# EAGLE design accelerometer_board (EAGLE 7.2.0)
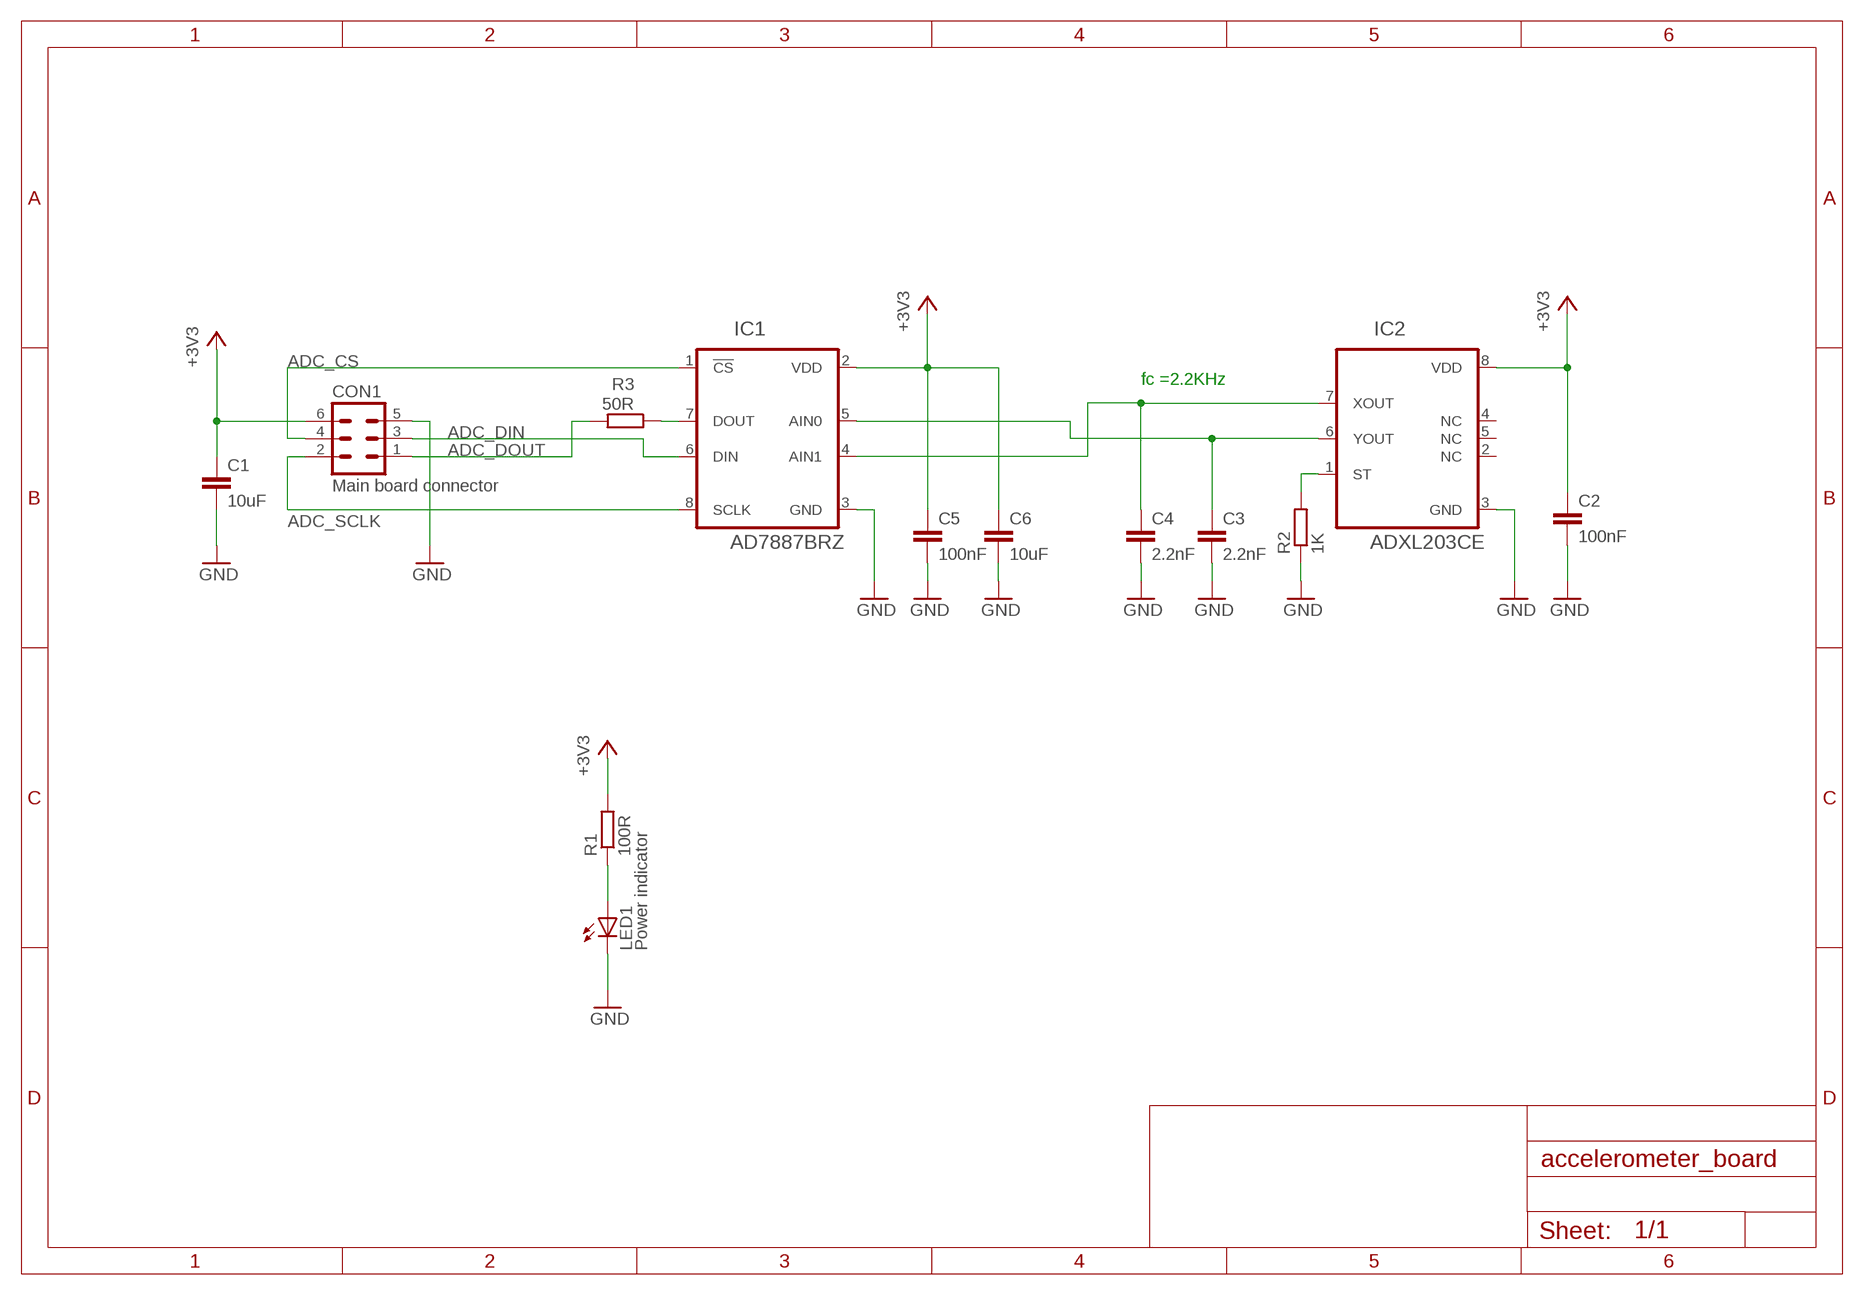
[diagram p0: schematic, sheet 1]

## Parts
C1  10uF  C-EUC1206K  [C1206K]
C2  100nF  C-EUC0805K  [C0805K]
C3  2.2nF  C-EUC0805K  [C0805K]
C4  2.2nF  C-EUC0805K  [C0805K]
C5  100nF  C-EUC0805K  [C0805K]
C6  10uF  C-EUC1206K  [C1206K]
CON1  Main board connector  ML6  [ML6]
IC1  AD7887BRZ  [SO08]
IC2  ADXL203CE  [LCC127P500X500X220-8N]
LED1  Power indicator  LEDCHIP-LED0805  [CHIP-LED0805]
R1  100R  R-EU_R0805  [R0805]
R2  1K  R-EU_R0805  [R0805]
R3  50R  R-EU_R0805  [R0805]

## Nets
+3V3 [power]: C1.1 C2.1 C5.1 C6.1 CON1.6 IC1.2(VDD) IC2.8(VDD) R1.2
ADC_CS: CON1.4 IC1.1(!CS)
ADC_DIN: CON1.3 IC1.6(DIN)
ADC_DOUT: CON1.1 R3.2
ADC_SCLK: CON1.2 IC1.8(SCLK)
GND [power]: C1.2 C2.2 C3.2 C4.2 C5.2 C6.2 CON1.5 IC1.3(GND) IC2.3(GND) LED1.C R2.1
N$5: C4.1 IC1.4(AIN1) IC2.7(XOUT)
N$7: LED1.A R1.1
N$8: IC2.1(ST) R2.2
N$9: IC1.7(DOUT) R3.1
N$10: C3.1 IC1.5(AIN0) IC2.6(YOUT)
Unconnected: IC2.2(NC) IC2.4(NC) IC2.5(NC)

## Notes on the sheet
- fc =2.2KHz

## Library data of the parts
C1-C6 = rcl:C-EU: CAPACITOR, European symbol
CON1 = con-harting-ml:ML6: HARTING; OC_FARNELL: unknown; OC_NEWARK: unknown
IC1 = tobylib:AD7887BRZ: AD7887: 2-channel 125Ksps 12bit ADC Datasheet <http://www.analog.com/media/en/technical-documentation/data-sheets/AD7887.pdf>
IC2 = tobylib:ADXL203CE: 2-axis Accelerometer ADXL203 Datasheet <http://www.analog.com/media/en/technical-documentation/data-sheets/ADXL103_203.pdf>; AVAILABILITY: Good; DESCRIPTION: Accelerometer Dual ±1.7g 3V to 6V 960mV/g to 1040mV/g 8-Pin CLCC T/R; MF: Analog Devices; MP: ADXL203CE-REEL; PACKAGE: CLCC-8 Analog Devices; PRICE: 19.20 USD
LED1 = led:LED: LED OSRAM: - CHIPLED LG R971, LG N971, LY N971, LG Q971, LY Q971, LO R971, LY R971 LH N974, LH R974 LS Q976, LO Q976, LY Q976 LO Q996 - Hyper CHIPLED LW Q18S LB Q993, LB Q99A, LB R99A - SideLED LS A670, LO A670, LY A670, LG A670, LP A670 LB A673, LV A673, LT A673, LW A673 LH A674 LY A675 LS A676, LA A676, LO A676, LY A676, LW A676 LS A679, LY A679, LG A679 - Hyper Micro SIDELED® LS Y876, LA Y876, LO Y876, LY Y876 LT Y87S - SmartLED LW L88C, LW L88S LB L89C, LB L89S, LG L890 LS L89K, LO L89K, LY L89K LS L896, LA L896, LO L896, LY L896 - TOPLED LS T670, LO T670, LY T670, LG T670, LP T670 LSG T670, LSP T670, LSY T670, LOP T670, LYG T670 LG T671, LOG T671, LSG T671 LB T673, LV T673, LT T673, LW T673 LH T674 LS T676, LA T676, LO T676, LY T676, LB T676, LH T676, LSB T676, LW T676 LB T67C, LV T67C, LT T67C, LS T67K, LO T67K, LY T67K, LW E67C LS E67B, LA E67B, LO E67B, LY E67B, LB E67C, LV E67C, LT E67C LW T67C LS T679, LY T679, LG T679 LS T770, LO T770, LY T770, LG T770, LP T770 LB T773, LV T773, LT T773, LW T773 LH T774 LS E675, LA E675, LY E675, LS T675 LS T776, LA T776, LO T776, LY T776, LB T776 LHGB T686 LT T68C, LB T68C - Hyper Mini TOPLED® LB M676 - Mini TOPLED Santana® LG M470 LS M47K, LO M47K, LY M47K Source: http://www.osram.convergy.de LUXEON: - LUMILED® LXK2-PW12-R00, LXK2-PW12-S00, LXK2-PW14-U00, LXK2-PW14-V00 LXK2-PM12-R00, LXK2-PM12-S00, LXK2-PM14-U00 LXK2-PE12-Q00, LXK2-PE12-R00, LXK2-PE12-S00, LXK2-PE14-T00, LXK2-PE14-U00 LXK2-PB12-K00, LXK2-PB12-L00, LXK2-PB12-M00, LXK2-PB14-N00, LXK2-PB14-P00, LXK2-PB14-Q00 LXK2-PR12-L00, LXK2-PR12-M00, LXK2-PR14-Q00, LXK2-PR14-R00 LXK2-PD12-Q00, LXK2-PD12-R00, LXK2-PD12-S00 LXK2-PH12-R00, LXK2-PH12-S00 LXK2-PL12-P00, LXK2-PL12-Q00, LXK2-PL12-R00 Source: www.luxeon.com KINGBRIGHT: KA-3528ASYC Source: www.kingbright.com
R1-R3 = rcl:R-EU_: RESISTOR, European symbol

## Net classes
1 power: width 0.61 mm

## Board
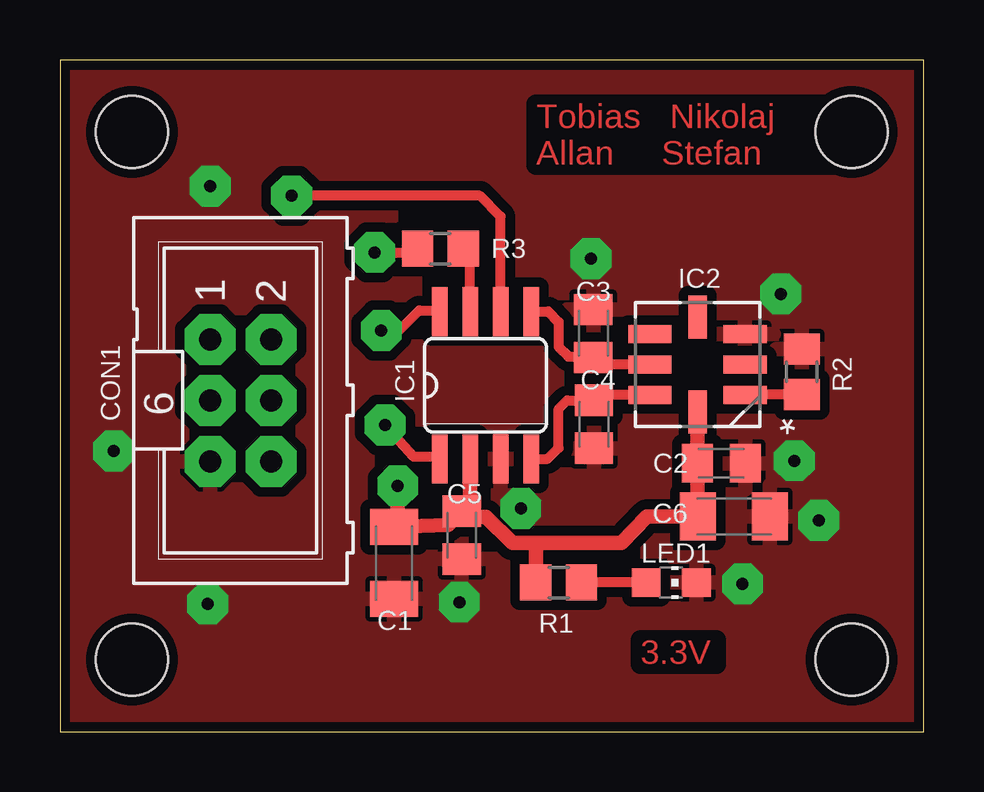
[diagram p1: board, top side]
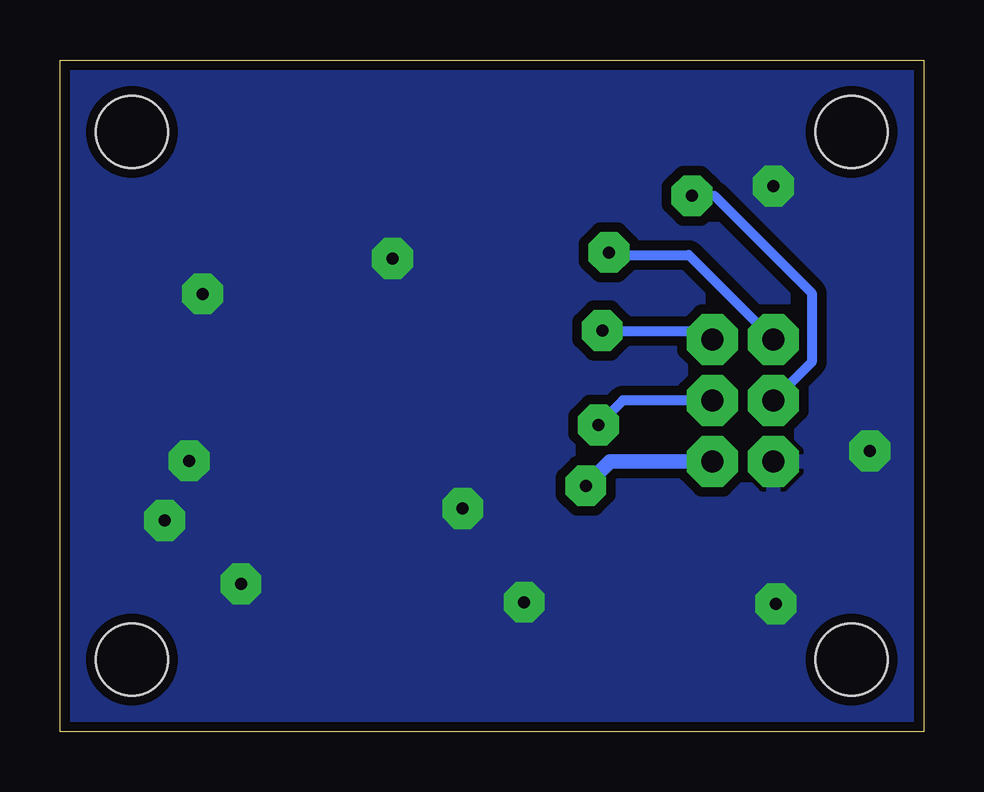
[diagram p2: board, bottom side, seen from below]

Size 36 x 28 mm. Coordinates in mm from the lower left corner, seen from the top.
Outline: 0,0 36,0 36,28 0,28 0,0
Copper layers (1*16): Top 0.035mm / dielectric 1.5mm / Bottom 0.035mm
Design rules "PCB-POOL Standard *": minimum track width 0.15mm, minimum drill 0.3mm, track to track 0.35mm, track to pad 0.3mm, pad to pad 0.2mm, via to via 0.15mm, smd to smd 0.15mm, copper to edge 0.3mm, drill to drill 0.2mm, minimum pad ring 0.6mm, minimum via ring 0.6mm, stop-mask expansion 0.075mm, vias tented up to drill 0mil, thermal gap 0.2mm
Holes 3 mm at 3,25 3,3 33,25 33,3

### Footprints (pad centres in the part's own frame; a part is rotated, then mirrored left to right if it is on the bottom)
C1206K = smd 1.5 x 2: 1 -1.5,0; 2 1.5,0
C0805K = smd 1.3 x 1.6: 1 -1,0; 2 1,0
ML6 = drill 0.914 octagon: 1 -2.54,-1.27; 2 -2.54,1.27; 3 0,-1.27; 4 0,1.27; 5 2.54,-1.27; 6 2.54,1.27
SO08 = smd 0.66 x 2.032: 1 -1.905,-3.073; 2 -0.635,-3.073; 3 0.635,-3.073; 4 1.905,-3.073; 5 1.905,3.073; 6 0.635,3.073; 7 -0.635,3.073; 8 -1.905,3.073
LCC127P500X500X220-8N = smd 1.803 x 0.762: 1 -1.981,1.27; 2 -1.981,0; 3 -1.981,-1.27; 5 1.981,-1.27; 6 1.981,0; 7 1.981,1.27 | smd 0.762 x 1.803: 4 0,-1.981; 8 0,1.981
CHIP-LED0805 = smd 1.2 x 1.2: A 0,-1.05; C 0,1.05
R0805 = smd 1.3 x 1.5: 1 -0.95,0; 2 0.95,0

### Placement (x,y rotation side)
C1  13.93,7.02 270 top
C2  27.57,11.19 0 top
C3  22.23,16.6 90 top
C4  22.26,12.81 270 top
C5  16.75,8.19 270 top
C6  28.1,8.98 0 top
CON1  7.53,13.8 270 top
IC1  17.74,14.44 0 top
IC2  26.58,15.3 180 top
LED1  25.49,6.21 270 top
R1  20.79,6.21 180 top
R2  30.92,15 270 top
R3  15.86,20.13 180 top

### Tracks (layer width: path | path; a pad name or v marks a point on that pad's centre or on a via)
+3V3  (via drill 0.5 pad 1.27)
  Top 0.61: IC2.8 C2.1 | C2.1 | C5.1 16.18,8.62 C1.1 14.08,8.75 v14.08,10.25 | IC1.2 17.1,9.54 C5.1 | 19.82,7.86 23.4,7.86 24.47,8.98 C6.1 26.58,8.83 C2.1 | 19.82,7.86 18.86,7.86 17.76,8.95 16.99,8.95 C5.1 | R1.2 19.84,7.84 19.82,7.86
  Bottom 0.61: CON1.6 13.06,11.26 v14.08,10.25
ADC_CS  (via drill 0.5 pad 1.27)
  Top 0.406: v13.55,12.79 14.74,11.47 15.73,11.47 IC1.1
  Bottom 0.406: CON1.4 12.53,13.8 v13.55,12.79
ADC_DIN  (via drill 0.5 pad 1.27)
  Top 0.406: IC1.6 18.37,21.47 17.51,22.34 v9.66,22.34
  Bottom 0.406: v9.66,22.34 8.72,22.34 4.66,18.27 4.66,15.4 CON1.3
ADC_DOUT  (via drill 0.5 pad 1.27)
  Top 0.406: v13.12,19.98 14.76,19.98 R3.2
  Bottom 0.406: 6.23,16.77 CON1.1 9.79,19.87 13.01,19.87 v13.12,19.98
ADC_SCLK  (via drill 0.5 pad 1.27)
  Top 0.406: v13.39,16.72 14.13,16.72 14.97,17.56 15.78,17.56 IC1.8
  Bottom 0.406: v13.39,16.72 13.37,16.7 9.15,16.7 CON1.2
GND  (via drill 0.5 pad 1.27)
  other vias: 19.21,9.31 6.26,22.74 22.13,19.72 30.06,18.25 31.63,8.8 30.62,11.29 28.46,6.16 2.24,11.69 6.16,5.32 16.65,5.4
  pour Bottom (isolate 0.406): -6.39,-4.26 -6.14,32.44 41.95,32.44 42.05,-4.08
  pour Top (isolate 0.406): -4.36,-2.13 -4.21,30.39 39.79,30.28 39.76,-2.15
N$5
  Top 0.406: IC2.7 22.48,14.03 C4.1 21.14,13.8 20.79,13.45 20.79,11.82 20.33,11.37 IC1.4
N$7
  Top 0.406: LED1.A R1.1
N$8
  Top 0.406: R2.2 28.57,14.05 IC2.1
N$9
  Top 0.406: IC1.7 17.1,19.83 R3.1
N$10
  Top 0.406: IC2.6 22.53,15.3 C3.1 22.2,15.63 21.19,15.63 20.79,16.04 20.79,17.08 20.36,17.51 IC1.5

### Text on the board
Top: Tobias Nikolaj / Allan Stefan | 3.3V